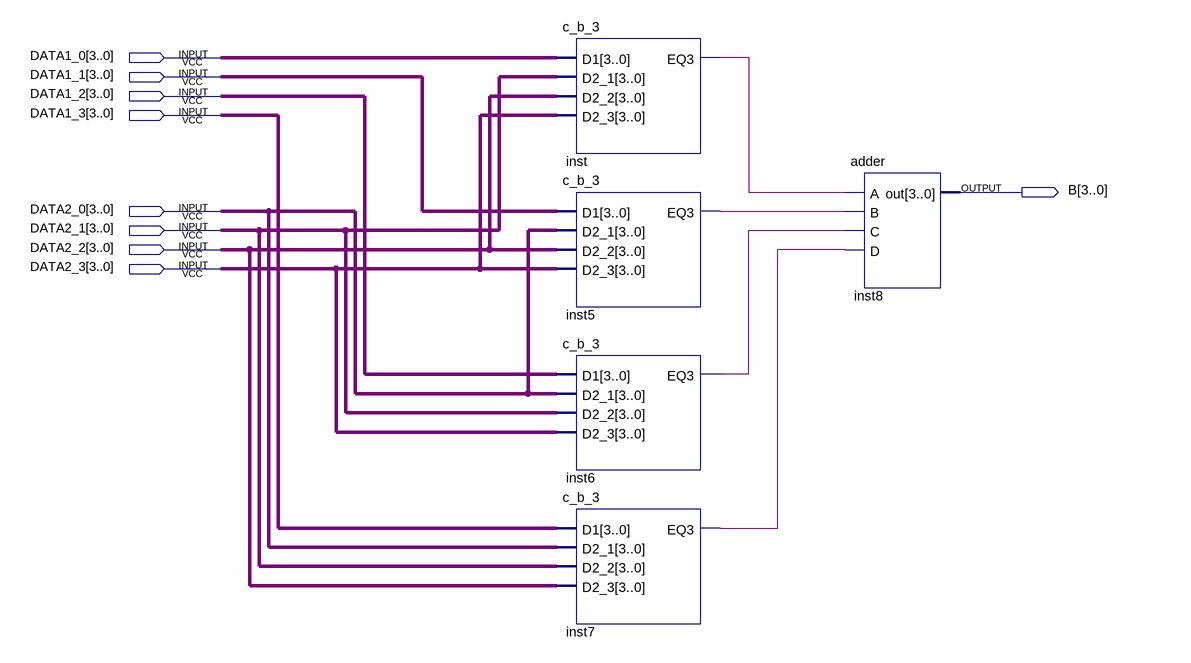
[diagram p0: schematic sheet]
// Quartus schematic B.bdf as structural Verilog: 5 symbols, 9 pins
module B (
  input  [3:0] DATA1_0,
  input  [3:0] DATA1_1,
  input  [3:0] DATA1_2,
  input  [3:0] DATA1_3,
  input  [3:0] DATA2_0,
  input  [3:0] DATA2_1,
  input  [3:0] DATA2_2,
  input  [3:0] DATA2_3,
  output [3:0] B
);

  wire inst5_eq3, inst6_eq3, inst7_eq3, inst_eq3;

  c_b_3 inst (.D1(DATA1_0), .D2_1(DATA2_1), .D2_2(DATA2_2), .D2_3(DATA2_3), .EQ3(inst_eq3));
  c_b_3 inst5 (.D1(DATA1_1), .D2_1(DATA2_0), .D2_2(DATA2_2), .D2_3(DATA2_3), .EQ3(inst5_eq3));
  c_b_3 inst6 (.D1(DATA1_2), .D2_1(DATA2_0), .D2_2(DATA2_1), .D2_3(DATA2_3), .EQ3(inst6_eq3));
  c_b_3 inst7 (.D1(DATA1_3), .D2_1(DATA2_0), .D2_2(DATA2_1), .D2_3(DATA2_2), .EQ3(inst7_eq3));
  adder inst8 (.A(inst_eq3), .B(inst5_eq3), .C(inst6_eq3), .D(inst7_eq3), .out(B));
endmodule
